# EasyEDA Pro project OSC-chaosheng.eprj, board 信号调节电路
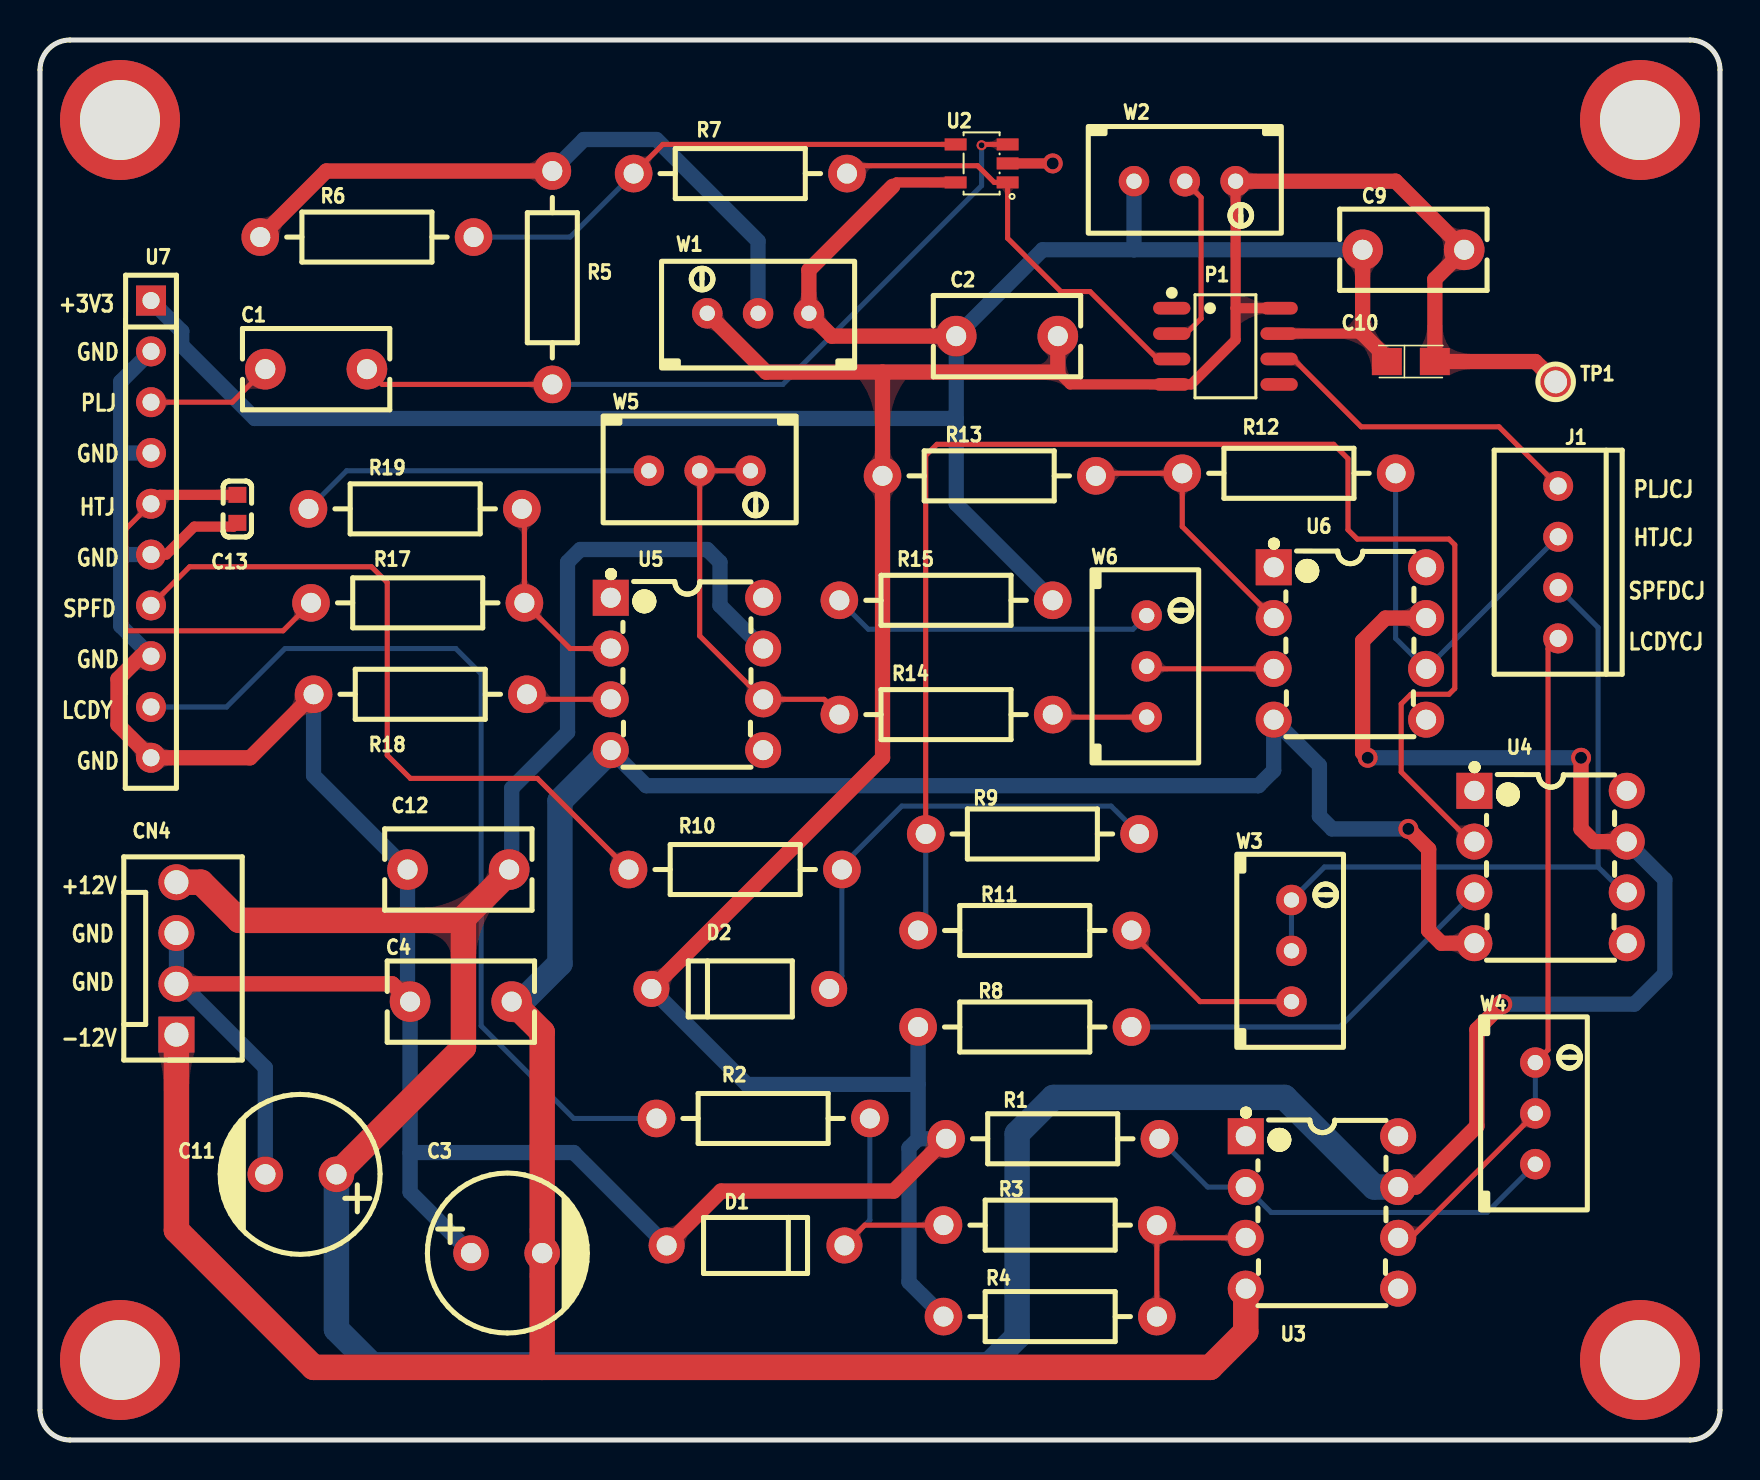
[diagram p9: board, top side]
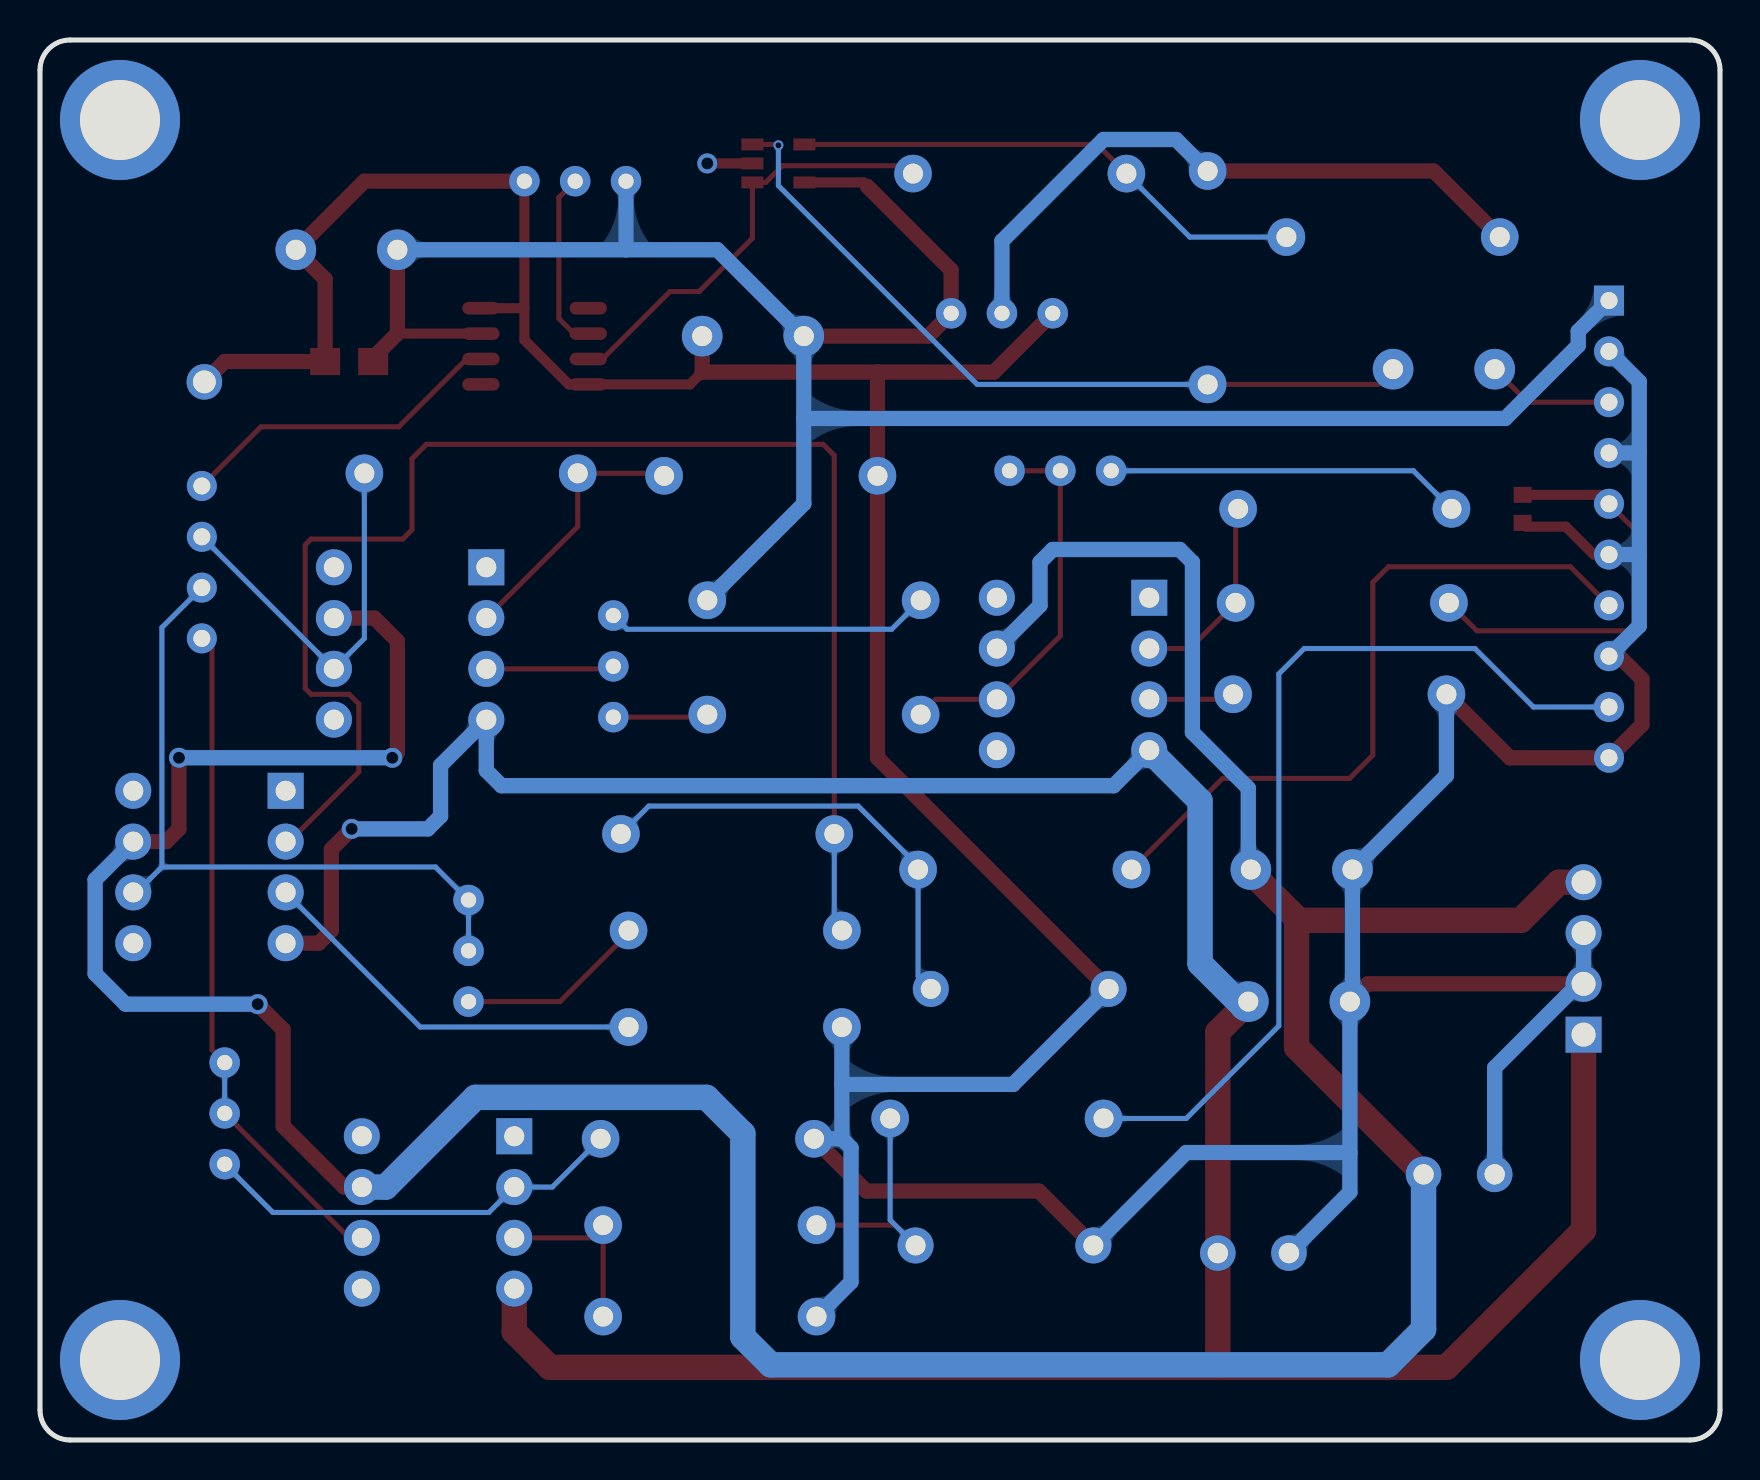
[diagram p10: board, bottom side, seen from below]

Outline 84 x 70 mm; copper layers: Top Layer, Bottom Layer. Coordinates in mm from the lower left corner of the outline.
Outline path: 0,68.5 0,1.5 arc(0.44,0.44) 1.5,0 82.5,0 arc(83.56,0.44) 84,1.5 84,68.5 arc(83.56,69.56) 82.5,70 1.5,70 arc(0.44,69.56) 0,68.5
Stack: Top Layer 0.035mm / Dielectric1 1.51mm FR4 er 4.5 / Bottom Layer 0.035mm

## Design rules (mm)
template: 自定义配置
spacing copperThickness1oz (default): track to track 0.203, other pairs 0.203 to 0.203
spacing copperThickness2oz: track to track 0.203, other pairs 0.152 to 0.3
track width copperThickness1oz (default): min 0.127, default 0.254, max 2.54
track width 5VandGND: min 0.254, default 0.762, max 2.54
track width 12V: min 0.254, default 1.27, max 2.54
differential pair differentialPair (default): width min 0.127, default 0.254, max 2.54; gap min 0.152, default 0.152
via viaSize (default): diameter min 0.5, default 0.61, max 10; hole min 0.3, default 0.305, max 6.299
net GND uses 5VandGND
net +12V uses 12V
net -12V uses 12V
net +3V3 uses 5VandGND
net 1.65V uses 5VandGND

## Placement (name value [footprint] x y rotation side)
C1  103  [CAP-TH_L7.2-W4.0-P5.00-D0.5]  13.81 53.54 0 top
C2  104  [CAP-TH_L7.2-W4.0-P5.00-D0.5]  48.35 55.19 0 top
C3  16V/470uF  [CAP-TH_BD8.0-P3.50-D0.6-FD]  23.33 9.35 0 top
C4  104  [cap-th_l7.2-w4.0-p5.00-d0.5]  21.04 21.92 0 top
C9  104  [CAP-TH_L7.2-W4.0-P5.00-D0.5]  68.67 59.51 0 top
C10  16V/2.2uF  [CASE-A_3216]  68.54 53.92 0 top
C11  16V/470uF  [CAP-TH_BD8.0-P3.50-D0.6-FD]  13.04 13.28 180 top
C12  104  [cap-th_l7.2-w4.0-p5.00-d0.5]  20.92 28.52 180 top
C13  330nF  [C0603]  9.87 46.56 90 top
CN4  12V电源  [CONN-TH_4P-P2.54_A2510S-4P]  6.82 24.08 90 top
D1  1N4007  [DO-41_BD2.4-L4.7-P8.70-D0.9-RD]  35.78 9.73 180 top
D2  1N4007  [DO-41_BD2.4-L4.7-P8.70-D0.9-RD]  35.01 22.55 0 top
J1  -  [CH2.54-4插座]  75.91 43.89 270 top
NOREF  -  [Pad_e7346]  80 4 0 top
NOREF#2  -  [Pad_e7345]  4 4 0 top
NOREF#3  -  [Pad_e7343]  4 66 0 top
NOREF#4  -  [Pad_e7344]  80 66 0 top
P1  TLV3501AIDR  [SOP-8_L4.9-W3.9-P1.27-LS6.0-BL]  59.27 54.69 270 top
R1  1kΩ  [RES-TH_BD2.5-L6.5-P10.50-D0.6]  50.64 15.06 180 top
R2  5.1kΩ  [RES-TH_BD2.5-L6.5-P10.50-D0.6]  36.16 16.08 180 top
R3  10kΩ  [RES-TH_BD2.5-L6.5-P10.50-D0.6]  50.51 10.74 180 top
R4  2.7kΩ  [RES-TH_BD2.5-L6.5-P10.50-D0.6]  50.51 6.17 0 top
R5  1kΩ  [RES-TH_BD2.5-L6.5-P10.50-D0.6]  25.62 58.11 90 top
R6  1kΩ  [RES-TH_BD2.5-L6.5-P10.50-D0.6]  16.35 60.15 180 top
R7  20kΩ  [RES-TH_BD2.5-L6.5-P10.50-D0.6]  35.01 63.32 180 top
R8  1kΩ  [RES-TH_BD2.5-L6.5-P10.50-D0.6]  49.24 20.65 0 top
R9  10kΩ  [RES-TH_BD2.5-L6.5-P10.50-D0.6]  49.62 30.3 0 top
R10  5.1kΩ  [RES-TH_BD2.5-L6.5-P10.50-D0.6]  34.76 28.52 180 top
R11  3.3kΩ  [RES-TH_BD2.5-L6.5-P10.50-D0.6]  49.24 25.47 180 top
R12  10kΩ  [RES-TH_BD2.5-L6.5-P10.50-D0.6]  62.45 48.33 180 top
R13  10kΩ  [RES-TH_BD2.5-L6.5-P10.50-D0.6]  47.46 48.21 180 top
R14  10kΩ  [RES-TH_BD2.5-L6.5-P10.50-D0.6]  45.3 36.27 0 top
R15  10kΩ  [RES-TH_BD2.5-L6.5-P10.50-D0.6]  45.3 41.98 0 top
R17  10kΩ  [RES-TH_BD2.5-L6.5-P10.50-D0.6]  18.89 41.86 180 top
R18  1kΩ  [RES-TH_BD2.5-L6.5-P10.50-D0.6]  19.01 37.29 0 top
R19  3.9kΩ  [RES-TH_BD2.5-L6.5-P10.50-D0.6]  18.76 46.56 0 top
TP1  GND  [TESTPOINT-TH_BD3.2]  75.78 52.91 0 top
U2  OPA356AIDBVR  [SOT-23-5_L3.0-W1.7-P0.95-LS2.8-BR]  47.08 63.83 0 top
U3  OP07  [DIP-8_L8.8-W6.4-P2.54-LS7.6-BL]  64.1 11.38 270 top
U4  OP07  [DIP-8_L8.8-W6.4-P2.54-LS7.6-BL]  75.53 28.65 270 top
U5  OP07  [DIP-8_L8.8-W6.4-P2.54-LS7.6-BL]  32.35 38.3 270 top
U6  OP07  [DIP-8_L8.8-W6.4-P2.54-LS7.6-BL]  65.5 39.83 270 top
U7  -  [CH2.54-10插座]  5.55 45.67 270 top
W1  1kΩ  [RES-ADJ-TH_3296W]  35.9 56.34 90 top
W2  1kΩ  [RES-ADJ-TH_3296W]  57.24 62.94 270 top
W3  1kΩ  [RES-ADJ-TH_3296W]  62.57 24.46 0 top
W4  1kΩ  [RES-ADJ-TH_3296W]  74.77 16.33 0 top
W5  2kΩ  [RES-ADJ-TH_3296W]  32.98 48.46 270 top
W6  1kΩ  [RES-ADJ-TH_3296W]  55.34 38.68 0 top

## Footprints (pads in the part's own frame, mm; a bottom-side part is the same pattern mirrored in y, then rotated)
C0603
  rect 0.8x0.9 smd: 1(-0.7,0) 2(0.7,0)
CAP-TH_BD8.0-P3.50-D0.6-FD
  round 1.778 hole 1.016: 1(-1.778,0) 2(1.778,0)
CAP-TH_L7.2-W4.0-P5.00-D0.5
  round 2.032 hole 1.001: 1(-2.54,0) 2(2.54,0)
cap-th_l7.2-w4.0-p5.00-d0.5
  round 2.032 hole 1.001: 1(-2.54,0) 2(2.54,0)
CASE-A_3216
  rect 1.5x1.359 smd: 1(-1.2,0) 2(1.2,0)
CH2.54-4插座
  round 1.5 hole 0.85: 1(-3.81,0) 2(-1.27,0) 3(1.27,0) 4(3.81,0)
CH2.54-10插座
  rect 1.5x1.5 hole 0.85: 1(-11.303,0)
  round 1.5 hole 0.85: 2(-8.763,0) 3(-6.223,0) 4(-3.683,0) 5(-1.143,0) 6(1.397,0) 7(3.937,0) 8(6.477,0) 9(9.017,0) 10(11.557,0)
CONN-TH_4P-P2.54_A2510S-4P
  rect 1.8x1.8 hole 1.2: 1(-3.81,0)
  round 1.8 hole 1.2: 2(-1.27,0) 3(1.27,0) 4(3.81,0)
DIP-8_L8.8-W6.4-P2.54-LS7.6-BL
  rect 1.801x1.801 hole 1.001: 1(-3.81,-3.81)
  round 1.801 hole 1.001: 2(-1.27,-3.81) 3(1.27,-3.81) 4(3.81,-3.81) 5(3.81,3.81) 6(1.27,3.81) 7(-1.27,3.81) 8(-3.81,3.81)
DO-41_BD2.4-L4.7-P8.70-D0.9-RD
  round 1.8 hole 1: 1(-4.445,0) 2(4.445,0)
Pad_e7343
  round 6 hole 4: 1(0,0)
Pad_e7344
  round 6 hole 4: 2(0,0)
Pad_e7345
  round 6 hole 4: 3(0,0)
Pad_e7346
  round 6 hole 4: 4(0,0)
RES-ADJ-TH_3296W
  round 1.524 hole 0.762: 1(0,2.54) 2(0,0) 3(0,-2.54)
RES-TH_BD2.5-L6.5-P10.50-D0.6
  round 1.879 hole 1: 1(-5.334,0) 2(5.334,0)
SOP-8_L4.9-W3.9-P1.27-LS6.0-BL
  oval 0.63x1.865 smd: 1(-1.905,-2.683) 2(-0.635,-2.683) 3(0.635,-2.683) 4(1.905,-2.683) 5(1.905,2.683) 6(0.635,2.683) 7(-0.635,2.683) 8(-1.905,2.683)
SOT-23-5_L3.0-W1.7-P0.95-LS2.8-BR
  rect 1.1x0.6 smd: 1(1.3,-0.95) 2(1.3,0) 3(1.3,0.95) 4(-1.3,0.95) 5(-1.3,-0.95)
TESTPOINT-TH_BD3.2
  round 1.778 hole 1.143: 1(0,0)

## Nets
As in the schematic, except:
GND: C2.2 C3.1 C4.1 C9.2 C10.2 C11.2 C12.2 C13.1 CN4.2 CN4.3 D1.2 D2.1 NOREF.4 NOREF#2.3 NOREF#3.1 NOREF#4.2 P1.4 P1.8 R1.2 R4.1 R8.1 R13.2 R18.1 TP1.1 U2.2 U7.2 U7.4 U7.6 U7.8 U7.10 W1.1 W2.1

Pads without a net: P1 1 5; U3 1 5 8; U4 1 5 8; U5 1 5 8; U6 1 5 8

## Via types
v1: diameter 1, hole 0.6, Top Layer to Bottom Layer, 5 vias
v2: diameter 0.5, hole 0.3, Top Layer to Bottom Layer, 1 via

## Routing (per net, layer and track width the routed paths; a pad name or vN(x,y) marks a point on that pad's centre or on a via; arc(x,y) is an arc through that point)
1.65V: length 32.6
  Top Layer w0.762: R5.2 14.31,63.45 R6.2
  Bottom Layer w0.762: R5.2 27.19,65.02 30.82,65.02 35.9,59.94 W1.2
+3V3: length 113.3
  Top Layer w0.508: 45.78,62.88 42.83,62.88 42.63,62.69 ; 66.13,55.32 P1.7
  Top Layer w0.762: 42.63,62.69 38.44,58.5 W1.3 39.59,55.19 C2.1 ; C9.1 66.13,55.32 67.34,54.11 C10.1
  Bottom Layer w0.762: C9.1 54.7,59.51 ; 54.7,59.51 W2.3 ; 54.7,59.51 50.13,59.51 C2.1 45.81,51.08 ; 45.81,51.08 45.81,46.81 R15.2 ; 45.81,51.08 10.74,51.08 7.09,54.72 7.09,55.43 U7.1
+12V: length 193.2
  Top Layer w0.762: U6.7 67.27,41.1 66.13,39.95 66.13,34.36 v1(66.38,34.11) ; U4.7 77.69,29.92 77.05,30.56 v1(77.05,34.11) ; U3.7 68.8,12.65 71.84,15.7 71.84,20.52 v1(73.12,21.79)
  Top Layer w1.27: C11.1 21.17,19.63 21.17,26.09 ; CN4.4 8.05,27.89 9.96,25.98 21.06,25.98 21.17,26.09 ; 21.17,26.09 23.46,28.38 C12.1
  Bottom Layer w0.762: C12.1 23.59,28.65 23.59,32.59 26.38,35.38 26.38,43.89 27.01,44.53 33.36,44.53 34,43.89 34,41.73 U5.7 ; U4.7 81.24,28.02 81.24,23.32 79.72,21.79 v1(73.12,21.79) ; v1(77.05,34.11) v1(66.38,34.11)
  Bottom Layer w1.27: C11.1 14.82,5.54 16.6,3.76 47.46,3.76 48.86,5.16 48.86,15.31 50.67,17.13 62.23,17.13 66.71,12.65 U3.7
-12V: length 158.1
  Top Layer w0.762: v1(68.42,30.56) 69.43,29.54 69.43,25.47 70.07,24.84 U4.4
  Top Layer w1.27: U3.4 60.29,5.41 58.51,3.63 25.11,3.63 ; C4.2 25.11,20.39 C3.2 25.11,3.63 ; 25.11,3.63 13.68,3.63 6.82,10.49 CN4.1
  Bottom Layer w0.762: v1(68.42,30.56) 64.61,30.56 63.97,31.19 63.97,33.73 U6.4 61.69,33.48 60.92,32.71 30.32,32.71 U5.4
  Bottom Layer w1.27: U5.4 26,31.95 26,23.82 24.09,21.92 C4.2
GND: length 265.1
  Top Layer w0.508: U7.6 6.31,44.27 7.71,45.67 9.68,45.67 C13.1 ; 59.78,56.59 59.78,55 57.56,52.78 P1.4 51.5,52.78 50.89,53.39 ; 59.78,56.59 P1.8 ; 59.78,56.59 W2.1 ; v1(50.64,63.83) U2.2
  Top Layer w0.762: W2.1 67.78,62.94 C9.2 69.74,58.04 C10.2 74.77,53.92 TP1.1 ; CN4.2 17.62,22.81 C4.1 ; 42.13,53.39 36.31,53.39 W1.1 ; 42.13,53.39 50.89,53.39 C2.2 ; 42.13,53.39 R13.2 42.13,34.11 D2.1 ; R1.2 42.69,12.45 34.05,12.45 D1.2 ; R18.1 10.5,34.11 U7.10 3.9,35.76 3.9,38.05 5.04,39.19 U7.8
  Bottom Layer w0.762: R18.1 13.68,33.22 C12.2 18.38,22.05 C4.1 18.5,14.37 ; D1.2 26.69,14.37 18.5,14.37 ; U7.4 4.04,49.35 ; 4.04,49.35 4.04,52.92 U7.2 ; 4.04,49.35 4.04,44.27 ; 43.91,15.06 R1.2 ; 43.91,15.06 43.45,14.6 43.45,7.9 45.18,6.17 ; 43.91,15.06 43.91,17.78 ; 43.91,17.78 35.34,17.78 D2.1 ; 43.91,17.78 R8.1 ; 18.5,14.37 18.5,12.39 C3.1 ; U7.8 4.04,40.71 4.04,44.27 ; 4.04,44.27 U7.6 ; CN4.3 CN4.2 7.07,22.81 11.27,18.61 C11.2
HTJ: length 21.2
  Top Layer w0.254: U7.5 4.29,45.55 4.29,40.46 12.16,40.46 R17.2
  Top Layer w0.508: C13.2 6,47.26 U7.5
HTJCJ: length 19.7
  Bottom Layer w0.254: R12.1 67.78,40.08 U6.6 J1.2
LCDY: length 46.5
  Bottom Layer w0.254: U7.9 9.33,36.65 12.25,39.57 20.79,39.57 22.06,38.31 22.06,20.71 26.69,16.08 R2.2
LCDYCJ: length 33.7
  Top Layer w0.254: W4.2 68.54,10.11 U3.6 ; W4.1 75.4,19.51 75.4,39.57 J1.4
  Bottom Layer w0.254: W4.2 W4.1
PLJ: length 6.4
  Top Layer w0.254: U7.3 9.61,51.89 C1.1
PLJCJ: length 16.6
  Top Layer w0.254: J1.1 72.95,50.66 66.06,50.66 62.67,54.05 P1.6
SPFD: length 36
  Top Layer w0.254: R10.2 24.87,33.08 18.52,33.08 17.36,34.24 17.36,42.87 16.57,43.66 7.48,43.66 U7.7
SPFDCJ: length 35.3
  Bottom Layer w0.254: 77.9,28.65 64.22,28.65 W3.1 W3.2 ; 77.9,28.65 79.17,27.38 U4.6 ; 77.9,28.65 77.9,40.62 J1.3
$1N599: length 22
  Top Layer w0.254: R7.1 40.74,63.71 46.88,63.71 47.71,62.88 48.38,62.88 48.38,60.09 51.04,57.42 52.5,57.42 55.88,54.05 P1.3
$1N608: length 38.5
  Top Layer w0.254: U2.3 47.12,64.78 v2(47.08,64.74) ; C1.2 17.11,52.78 R5.1
  Bottom Layer w0.254: R5.1 37.14,52.78 47.08,62.72 v2(47.08,64.74)
$1N609: length 26
  Top Layer w0.254: U2.4 31.14,64.78 R7.2
  Bottom Layer w0.254: R6.1 26.51,60.15 R7.2
$1N620: length 9
  Top Layer w0.254: W2.2 58.06,62.12 58.06,56.07 57.3,55.32 P1.2
$2N344: length 23.1
  Bottom Layer w0.254: R9.2 53.56,31.7 43.09,31.7 40.09,28.7 R10.1 40.09,23.19 D2.2
$2N350: length 9.6
  Top Layer w0.254: W3.3 58,21.92 54.45,25.47
$2N352: length 19.9
  Bottom Layer w0.254: R8.2 64.99,20.65 U4.3
$2N353: length 73.5
  Top Layer w0.254: R9.1 44.29,49.22 44.85,49.78 64.68,49.78 65.4,49.07 65.4,45.51 65.86,45.05 70.45,45.05 70.74,44.76 70.74,37.58 70.45,37.29 68.54,37.29 68.06,36.8 68.06,33.4 71.54,29.92 U4.2
  Bottom Layer w0.254: 43.78,25.47 44.29,25.98 R9.1
$2N682: length 12.2
  Top Layer w0.254: D1.1 41.24,10.74 45.18,10.74
  Bottom Layer w0.254: D1.1 41.49,11 R2.1
$2N687: length 9
  Top Layer w0.254: 55.84,10.11 R3.1 ; 55.84,10.11 U3.3 ; 55.84,10.11 R4.2
$2N689: length 21.3
  Bottom Layer w0.254: R1.1 58.38,12.65 U3.2 61.56,11.38 72.35,11.38 W4.3
$2N1425: length 4.3
  Top Layer w0.254: U5.3 24.6,37.03 R18.2
$2N1427: length 17.8
  Bottom Layer w0.254: W5.3 15.33,48.46 R19.1
$2N1428: length 10
  Top Layer w0.254: R19.2 24.22,46.43 R17.1 26.51,39.57 U5.2
$2N1431: length 6.4
  Top Layer w0.254: U6.3 55.46,38.56 W6.2
$2N1432: length 4.8
  Top Layer w0.254: R14.2 50.76,36.14 W6.3
$2N1433: length 16.3
  Bottom Layer w0.254: R15.1 41.42,40.54 54.65,40.54 W6.1
$2N1434: length 19.4
  Top Layer w0.254: R14.1 39.21,37.03 U5.6 32.98,40.21 W5.2 W5.1
$2N1437: length 13.5
  Top Layer w0.254: U6.2 57.11,45.67 R12.2 52.92,48.33 R13.1

## Copper pours and planes (outline as drawn; the poured copper is in the pictures)
GND on Top Layer: -7.53,76.53 92.16,76.53 92.16,-4.75 -7.53,-4.75
GND on Bottom Layer: -6.7,75.77 90.51,75.77 90.51,-4.37 -6.7,-4.37

Small or netless copper shapes (teardrops, artwork), in the pictures only: 102 on Top Layer, 81 on Bottom Layer

## Text on the board
Top Silkscreen Layer: +3V3 | +12V | -12V | LCDY | SPFD | GND | HTJ | PLJ | SPFDCJ | LCDYCJ | PLJCJ | HTJCJ
